# EasyEDA Pro project chunithm.epro, board PCB3
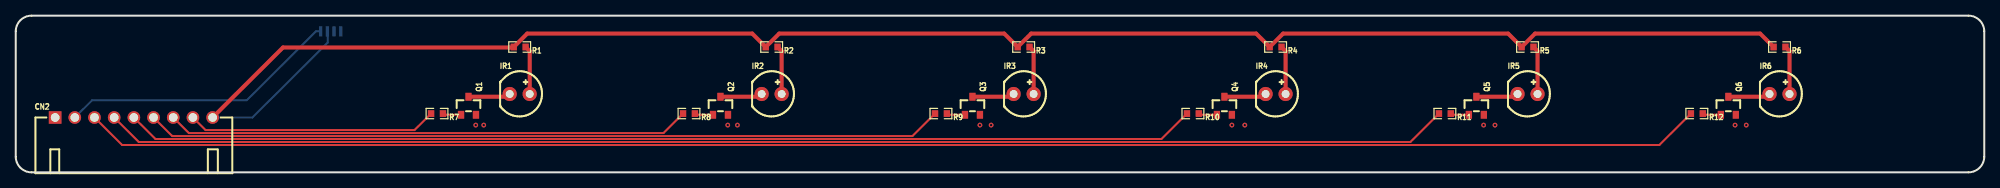
[diagram p3: board, top side]
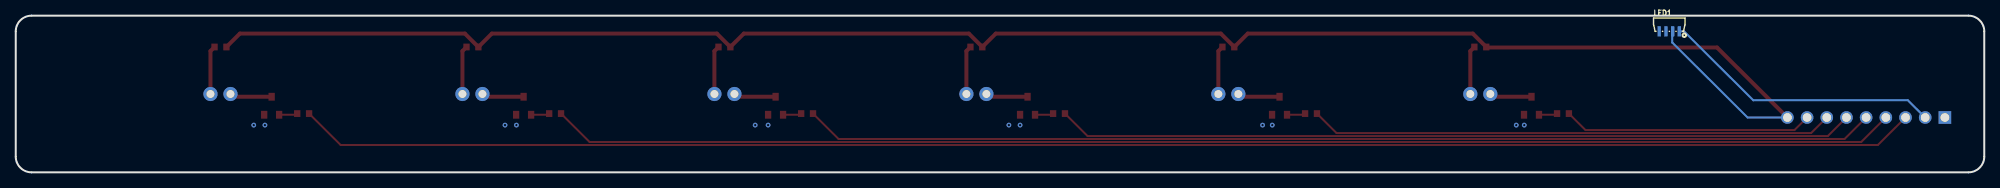
[diagram p4: board, bottom side, seen from below]

Outline 250 x 20 mm; copper layers: Top Layer, Bottom Layer. Coordinates in mm from the lower left corner of the outline.
Outline path: 0,18 0,2 arc(0.59,0.59) 2,0 248,0 arc(249.41,0.59) 250,2 250,18 arc(249.41,19.41) 248,20 2,20 arc(0.59,19.41) 0,18
Stack: Top Layer 0.035mm / Dielectric1 1.51mm FR4 er 4.5 / Bottom Layer 0.035mm

## Design rules (mm)
template: JLCPCB Capability(Two Layers Board)
spacing copperThickness1oz (default): track to track 0.102, other pairs 0.152 to 0.3
spacing copperThickness2oz: track to track 0.203, other pairs 0.152 to 0.3
track width copperThickness1oz (default): min 0.127, default 0.254, max 2.54
track width copperThickness2oz: min 0.203, default 0.254, max 2.54
differential pair differentialPair (default): width min 0.127, default 0.254, max 2.54; gap min 0.152, default 0.152
via viaSize (default): diameter min 0.5, default 0.61, max 10; hole min 0.3, default 0.305, max 6.3

## Placement (name value [footprint] x y rotation side)
CN2  X8821WR-09S-N0SN  [CONN-TH_9P-P2.50_X8821WR-09S-N2SN]  15 7 0 top
IR1  IR333C-A  [LED-TH_BD5.9-P2.54-RD_WHITE]  64 10 0 top
IR2  IR333C-A  [LED-TH_BD5.9-P2.54-RD_WHITE]  96 10 0 top
IR3  IR333C-A  [LED-TH_BD5.9-P2.54-RD_WHITE]  128 10 0 top
IR4  IR333C-A  [LED-TH_BD5.9-P2.54-RD_WHITE]  160 10 0 top
IR5  IR333C-A  [LED-TH_BD5.9-P2.54-RD_WHITE]  192 10 0 top
IR6  IR333C-A  [LED-TH_BD5.9-P2.54-RD_WHITE]  224 10 0 top
LED1  WS2812B-4020  [LED-SMD_WS2812B-4020]  40 18 180 bottom
Q1  AO3400  [SOT-23_L2.9-W1.3-P1.90-LS2.4-BR]  57.5 8.5 270 top
Q2  AO3400  [SOT-23_L2.9-W1.3-P1.90-LS2.4-BR]  89.5 8.5 270 top
Q3  AO3400  [SOT-23_L2.9-W1.3-P1.90-LS2.4-BR]  121.5 8.5 270 top
Q4  AO3400  [SOT-23_L2.9-W1.3-P1.90-LS2.4-BR]  153.5 8.5 270 top
Q5  AO3400  [SOT-23_L2.9-W1.3-P1.90-LS2.4-BR]  185.5 8.5 270 top
Q6  AO3400  [SOT-23_L2.9-W1.3-P1.90-LS2.4-BR]  217.5 8.5 270 top
R1  18  [R0603]  64 16 180 top
R2  18  [R0603]  96 16 180 top
R3  18  [R0603]  128 16 180 top
R4  18  [R0603]  160 16 180 top
R5  18  [R0603]  192 16 180 top
R6  18  [R0603]  224 16 180 top
R7  200  [R0603]  53.5 7.5 180 top
R8  200  [R0603]  85.5 7.5 180 top
R9  200  [R0603]  117.5 7.5 180 top
R10  200  [R0603]  149.5 7.5 180 top
R11  200  [R0603]  181.5 7.5 180 top
R12  200  [R0603]  213.5 7.5 180 top

## Footprints (pads in the part's own frame, mm; a bottom-side part is the same pattern mirrored in y, then rotated)
CONN-TH_9P-P2.50_X8821WR-09S-N2SN
  rect 1.6x1.6 hole 1.1: 1(-10,0)
  round 1.6 hole 1.1: 2(-7.5,0) 3(-5,0) 4(-2.5,0) 5(0,0) 6(2.5,0) 7(5,0) 8(7.5,0) 9(10,0)
LED-SMD_WS2812B-4020
  rect 0.42x1.3 smd: 1(1.275,0) 2(0.425,0) 3(-0.425,0) 4(-1.275,0)
LED-TH_BD5.9-P2.54-RD_WHITE
  round 1.8 hole 1: 1(-1.27,0) 2(1.27,0)
R0603
  rect 0.806x0.864 smd: 1(-0.753,0) 2(0.753,0)
SOT-23_L2.9-W1.3-P1.90-LS2.4-BR
  rect 1x0.8 smd: 1(1.15,-0.95) 2(1.15,0.95) 3(-1.15,0)

## Nets
As in the schematic.

Pads without a net: LED1 3

## Via types
v1: diameter 0.61, hole 0.305, Top Layer to Bottom Layer, 12 vias

## Routing (per net, layer and track width the routed paths; a pad name or vN(x,y) marks a point on that pad's centre or on a via; arc(x,y) is an arc through that point)
+5V: length 229.1
  Top Layer w0.508: R6.2 221.53,17.71 192.96,17.71 R5.2 189.53,17.71 160.96,17.71 R4.2 157.53,17.71 128.96,17.71 R3.2 125.53,17.71 96.96,17.71 R2.2 93.53,17.71 64.96,17.71 R1.2 63.18,15.94 33.94,15.94 CN2.9
  Bottom Layer w0.254: CN2.9 30.05,7 39.62,16.57 39.62,17.95 LED1.2
GND:
  vias: v1(58.42,6.03) v1(59.44,6.03) v1(90.42,6.03) v1(91.65,6.03) v1(122.45,6.03) v1(123.87,6.03) v1(154.45,6.03) v1(156.09,6.03) v1(186.42,6.03) v1(187.86,6.03) v1(218.35,6.03) v1(219.78,6.03)
IR_TX0: length 31.8
  Top Layer w0.254: R7.2 50.64,5.39 24.1,5.39 CN2.8
IR_TX1: length 66.6
  Top Layer w0.254: CN2.7 21.99,5.01 82.26,5.01 R8.2
IR_TX2: length 101.4
  Top Layer w0.254: R9.2 113.88,4.63 19.87,4.63 CN2.6
IR_TX3: length 136.2
  Top Layer w0.254: R10.2 145.5,4.25 17.75,4.25 CN2.5
IR_TX4: length 171
  Top Layer w0.254: R11.2 177.12,3.87 15.63,3.87 CN2.4
IR_TX5: length 205.9
  Top Layer w0.254: R12.2 208.74,3.49 13.51,3.49 CN2.3
LEFT_AIR_RGB: length 35.8
  Bottom Layer w0.254: CN2.2 9.7,9.2 29.34,9.2 38.13,18 LED1.1
$1N667: length 5.4
  Top Layer w0.508: IR1.1 62.38,9.65 Q1.3
$1N697: length 5.4
  Top Layer w0.508: IR2.1 94.38,9.65 Q2.3
$1N727: length 5.4
  Top Layer w0.508: IR3.1 126.38,9.65 Q3.3
$1N757: length 5.4
  Top Layer w0.508: Q4.3 158.38,9.65 IR4.1
$1N787: length 5.4
  Top Layer w0.508: Q5.3 190.38,9.65 IR5.1
$1N817: length 5.4
  Top Layer w0.508: Q6.3 222.38,9.65 IR6.1
$1N915: length 6.2
  Top Layer w0.508: IR2.2 97.27,15.48 R2.1
$1N951: length 6.2
  Top Layer w0.508: IR3.2 129.27,15.48 R3.1
$1N987: length 6.2
  Top Layer w0.508: IR4.2 161.27,15.48 R4.1
$1N1023: length 6.2
  Top Layer w0.508: R5.1 193.27,15.48 IR5.2
$1N1059: length 6.2
  Top Layer w0.508: R6.1 225.27,15.48 IR6.2
$1N1095: length 6.2
  Top Layer w0.508: IR1.2 65.27,15.48 R1.1
$1N1288: length 2.4
  Top Layer w0.254: Q2.1 86.4,7.35 R8.1
$1N1324: length 2.4
  Top Layer w0.254: R9.1 118.4,7.35 Q3.1
$1N1360: length 2.4
  Top Layer w0.254: R10.1 150.4,7.35 Q4.1
$1N1396: length 2.4
  Top Layer w0.254: Q5.1 182.4,7.35 R11.1
$1N1432: length 2.4
  Top Layer w0.254: R12.1 214.4,7.35 Q6.1
$1N1498: length 2.4
  Top Layer w0.254: Q1.1 54.4,7.35 R7.1

## Copper pours and planes (outline as drawn; the poured copper is in the pictures)
GND on Top Layer: -22.61,43.75 275.97,43.75 275.97,-29.28 -22.61,-29.28
GND on Bottom Layer: -9.91,30.29 262.13,30.29 262.13,-9.34 -9.91,-9.34
